# Altium schematic sheet CD4060BM_硬件定时器.SchDoc
size A4
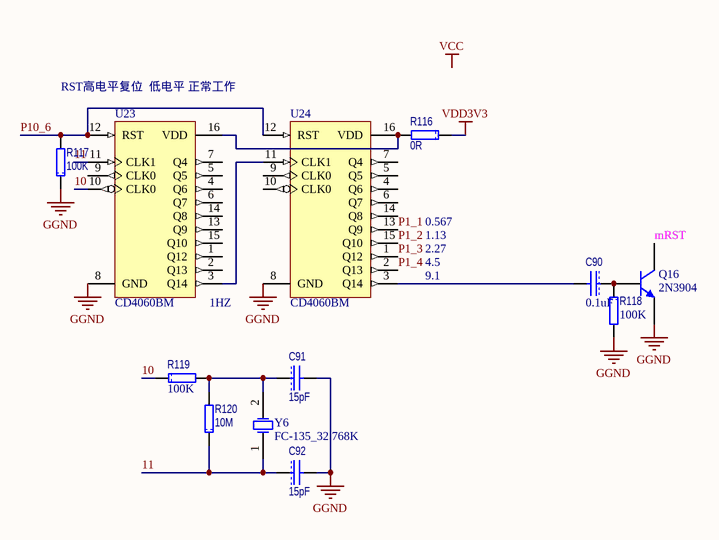
[diagram p0: CD4060BM_硬件定时器.SchDoc]

## Parts
C90  value 0.1uF  [1608[0603]C]  (hidden comment: C1608X7R1H104K)
C91  15pF  [1608[0603]]
C92  15pF  [1608[0603]]
Q16  2N3904  [SOT23_N]
R116  0R  [1608[0603]R]
R117  100K  [1608[0603]R]
R118  value 100K  [1608[0603]R]  (hidden comment: CRCW0603100KFKEA)
R119  value 100K  [1608[0603]R]  (hidden comment: CRCW0603100KFKEA)
R120  10M  [1608[0603]R]
U23  CD4060BM  [SOIC16_N]
U24  CD4060BM  [SOIC16_N]
Y6  FC-135_32.768K  [FC-135]

## Nets
GGND: C91.2 C92.2 Q16.1(E) R117.1 R118.2 U23.8(GND) U24.8(GND)
VDD3V3: R116.1
10: R119.1 U23.10(CLK0)
11: C92.1 R120.1 U23.11(CLK1) Y6.1(OSC1)
mRST: Q16.3(C)
P1_1: U24.13(Q9)
P1_2: U24.15(Q10)
P1_3: U24.1(Q12)
P1_4: U24.2(Q13)
P10_6: R117.2 U23.12(RST) U24.12(RST)
NetC90_1: C90.1 Q16.2(B) R118.1
NetC90_2: C90.2 U24.3(Q14)
NetC91_1: C91.1 R119.2 R120.2 Y6.2(OSC2)
NetR116_2: R116.2 U23.16(VDD) U24.16(VDD)
NetU23_3: U23.3(Q14) U24.11(CLK1)

Not connected (* = marked no-connect by the designer): U23 1(Q12) 2(Q13) 4(Q6) 5(Q5) 6(Q7) 7(Q4) 9(CLK0) 13(Q9) 14(Q8) 15(Q10); U24 4(Q6) 5(Q5) 6(Q7) 7(Q4) 9(CLK0) 10(CLK0) 14(Q8)

## Notes on the sheet
- RST高电平复位  低电平 正常工作
- 2.27
- 1.13
- 0.567
- (near U23) 1HZ
- 9.1
- 4.5
- Labels drawn without touching a wire or pin: VCC

## Library data of the parts
C90 = CAP: 多层陶瓷电容器MLCC - SMD/SMT 0603 0.1uF 50volts X7R 10%; Manufacturer: TDK; 产品: General Type MLCCs; 产品种类: Low & Medium Capacitance SMD Ceramic Chip Capacitors; 外壳代码 - in: 0603; 外壳代码 - mm: 1608; 封装 / 箱体: 0603 (1608 metric); 封装: Reel; 尺寸: 0.8 mm W x 1.6 mm L x 0.8 mm H; 工作温度范围: - 55 C to + 125 C; 标准包装数量: 4000; 电压额定值: 50 V; 电容-nF: 100 nF; 电容-pF: 100000 pF; 系列: C; Category: 多层陶瓷电容器MLCC - SMD/SMT; ComponentLink1Description: http://www.tdk.com/pdf/general_B11.pdf; ComponentLink1URL: http://www.tdk.com/pdf/general_B11.pdf; Description 1: 多层陶瓷电容器MLCC - SMD/SMT 0603 0.1uF 50volts X7R 10%; Manufacturer Part Number: C1608X7R1H104K; Minimum Order Quantity: 1; Pricing 1: 1=0.160, 50=0.070, 100=0.036, 500=0.019, 1000=0.013, 4000=0.010, 8000=0.009, 12000=0.008, 20000=0.007 (USD); Reeling: True; RoHS - 贸泽: Y; RoHS: RoHS Compliant; Stock 1: 224604; Supplier 1: Mouser; Supplier Part Number 1: 810-C1608X7R1H104K; 制造商: TDK; 容差: 10 %; 温度系数/代码: X7R; 电容: 0.1 uF; 端接类型: SMD/SMT
C91 C92 = CAP: Capacitor; Manufacturer: TDK; Type: 无铅电容; Model: C0603X7R1H150K; Value: 15pF
Q16 = 2N3904: NPN General Purpose Amplifier; Published: 8-Jun-2000; LatestRevisionDate: 15-Jan-2003; LatestRevisionNote: PCB Footprint 'BCY-W3/D4.7' replaced; DatasheetVersion: 1997; PackageVersion: Sep-1998; PackageReference: TO-92A; Publisher: Altium Limited; PackageDescription: TO, Flat Index; 3 In-Line, Axial Leads; Body Dia. 4.5mm; Leads 0.51 x 0.48 mm (max); ComponentLink1Description: Manufacturer Link; ComponentLink1URL: http://www.fairchildsemi.com/; ComponentLink2Description: Datasheet; ComponentLink2URL: http://www.fairchildsemi.com/ds/2N%2F2N3904.pdf
R116 = RES: Model: RT0603DRD7D0RL; 公司: vishay; Parameters: 50V 1/10W 0.5%; Type: 无铅电阻; Value: 0R
R117 = RES: Model: RT0603DRD7D100KL; 公司: vishay; Parameters: 50V 1/10W 0.5%; Type: 无铅电阻; Value: 100K
R118 R119 = RES: 厚膜电阻器 - SMD 1/10watt 100Kohms 1%; Manufacturer: Vishay / Dale; 尺寸: 0.85 mm W x 1.55 mm L x 0.45 mm H; 工作温度范围: - 55 C to + 155 C; 封装 / 箱体: 0603 (1608 metric); 封装: Reel; 功率额定值: 100 mW; 产品: Thick Film Resistors SMD; 系列: CRCW; 温度系数: 100 PPM / K; 端接类型: SMD/SMT; 电压额定值: 75 V; 制造商: Vishay; 产品种类: 0603 Thick Film Chip Resistors; 标准包装数量: 5000; 外壳代码 - in: 0603; 外壳代码 - mm: 1608; Supplier 1: Mouser; Supplier Part Number 1: 71-CRCW0603-100K-E3; Manufacturer Part Number: CRCW0603100KFKEA; RoHS: RoHS Compliant By Exemption; Category: 厚膜电阻器 - SMD; Stock 1: 175756; Pricing 1: 1=0.080, 10=0.013, 100=0.010, 1000=0.008, 5000=0.005, 25000=0.004, 50000=0.003 (USD); 电阻: 100 kOhms; 容差: 1 %; RoHS - 贸泽: E; Minimum Order Quantity: 1; Reeling: True; ComponentLink1URL: http://www.mouser.com/ds/2/427/dcrcwe3-109170.pdf; ComponentLink1Description: http://www.mouser.com/ds/2/427/dcrcwe3-109170.pdf; Description 1: 厚膜电阻器 - SMD 1/10watt 100Kohms 1%
R120 = RES: Model: RT0603DRD7D10ML; 公司: vishay; Parameters: 50V 1/10W 0.5%; Type: 无铅电阻; Value: 10M
U23 U24 = CD4060BCM: 14-Stage Ripple Carry Binary Counter; Published: 17-Jul-2002; LatestRevisionDate: 13-Apr-2006; LatestRevisionNote: IPC-7351 Footprint Added.; DatasheetVersion: Jan-1999; PackageVersion: 2000; PackageReference: M16A; Publisher: Altium Limited; PackageDescription: 16-Pin Small Outline Integrated Circuit 1.27 mm Pitch; Code_IPC: SOIC127P600-16; ComponentLink1Description: Manufacturer Link; ComponentLink1URL: http://www.fairchildsemi.com/; ComponentLink2Description: Datasheet; ComponentLink2URL: http://www.fairchildsemi.com/ds/CD%2FCD4040BC.pdf
Y6 = XTAL: Crystal Oscillator; 公司: EPSON; Published: 8-Jun-2000; LatestRevisionDate: 17-Jul-2002; LatestRevisionNote: Re-released for DXP Platform.; PackageReference: R38; Publisher: Altium Limited; PackageDescription: Crystal, Thru-Hole; 2 Leads; Body 3.1 x 8.2 mm (Dia.xH); Value: 32.768K